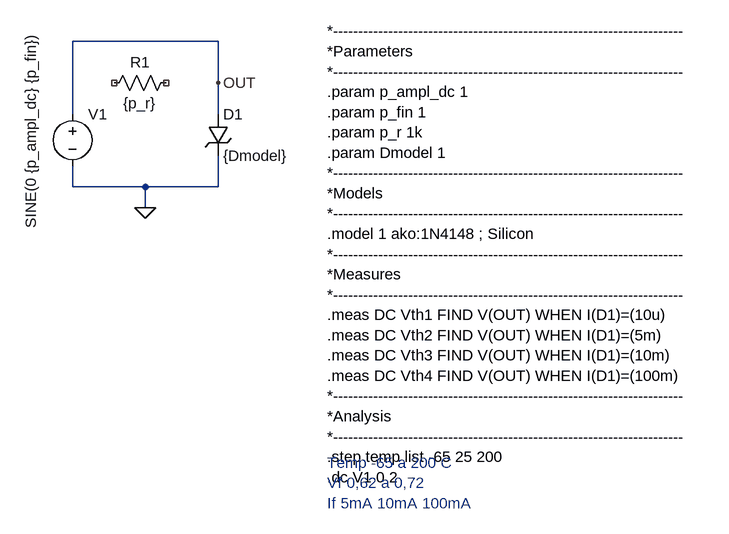
[diagram p0: schematic DIODE_1N4148.asc]
DIODE_1N4148.asc, the LTspice schematic file:
Version 4
SHEET 1 1236 688
WIRE 336 -32 112 -32
WIRE 336 32 336 -32
WIRE 112 80 112 -32
WIRE 336 80 336 32
WIRE 112 192 112 160
WIRE 224 192 112 192
WIRE 336 192 336 144
WIRE 336 192 224 192
WIRE 224 224 224 192
FLAG 224 224 0
FLAG 336 32 OUT
SYMBOL voltage 112 64 R0
WINDOW 3 -64 -111 VRight 2
WINDOW 123 0 0 Left 0
WINDOW 39 0 0 Left 0
SYMATTR Value SINE(0 {p_ampl_dc} {p_fin})
SYMATTR InstName V1
SYMBOL res 272 16 R90
WINDOW 0 0 56 VBottom 2
WINDOW 3 32 56 VTop 2
SYMATTR InstName R1
SYMATTR Value {p_r}
SYMBOL zener 320 80 R0
SYMATTR InstName D1
SYMATTR Value {Dmodel}
SYMATTR Description Diode
SYMATTR Type diode
TEXT 504 -48 Left 2 !*----------------------------------------------------------------------\n*Parameters\n*----------------------------------------------------------------------\n.param p_ampl_dc 1\n.param p_fin 1\n.param p_r 1k\n.param Dmodel 1\n*----------------------------------------------------------------------\n*Models\n*----------------------------------------------------------------------\n.model 1 ako:1N4148 ; Silicon\n*----------------------------------------------------------------------\n*Measures\n*----------------------------------------------------------------------\n.meas DC Vth1 FIND V(OUT) WHEN I(D1)=(10u)\n.meas DC Vth2 FIND V(OUT) WHEN I(D1)=(5m)\n.meas DC Vth3 FIND V(OUT) WHEN I(D1)=(10m)\n.meas DC Vth4 FIND V(OUT) WHEN I(D1)=(100m)\n*----------------------------------------------------------------------\n*Analysis\n*----------------------------------------------------------------------\n.step temp list -65 25 200\n.dc V1 0 2
TEXT 504 616 Left 2 ;Temp -65 a 200 C\nVf 0,62 a 0,72\nIf 5mA 10mA 100mA

The netlist it stands for:
* DIODE_1N4148.asc
V1 OUT 0 SINE(0 {p_ampl_dc} {p_fin})
R1 NC_01 NC_02 {p_r}
D1 OUT 0 {Dmodel}
.model D D
.lib standard.dio
*----------------------------------------------------------------------
*Parameters
*----------------------------------------------------------------------
.param p_ampl_dc 1
.param p_fin 1
.param p_r 1k
.param Dmodel 1
*----------------------------------------------------------------------
*Models
*----------------------------------------------------------------------
.model 1 ako:1N4148 ; Silicon
*----------------------------------------------------------------------
*Measures
*----------------------------------------------------------------------
.meas DC Vth1 FIND V(OUT) WHEN I(D1)=(10u)
.meas DC Vth2 FIND V(OUT) WHEN I(D1)=(5m)
.meas DC Vth3 FIND V(OUT) WHEN I(D1)=(10m)
.meas DC Vth4 FIND V(OUT) WHEN I(D1)=(100m)
*----------------------------------------------------------------------
*Analysis
*----------------------------------------------------------------------
.step temp list -65 25 200
.dc V1 0 2
* Temp -65 a 200 C
* Vf 0,62 a 0,72
* If 5mA 10mA 100mA
.backanno
.end